# EasyEDA schematic EdgePowerMeter_EasyEDA.json
TITLE: EdgePowerMeter; REV: 1.0; Date: 2025-10-24; Sheet: 1/1; Drawn By: Daniel Rossi; Company: Projecto
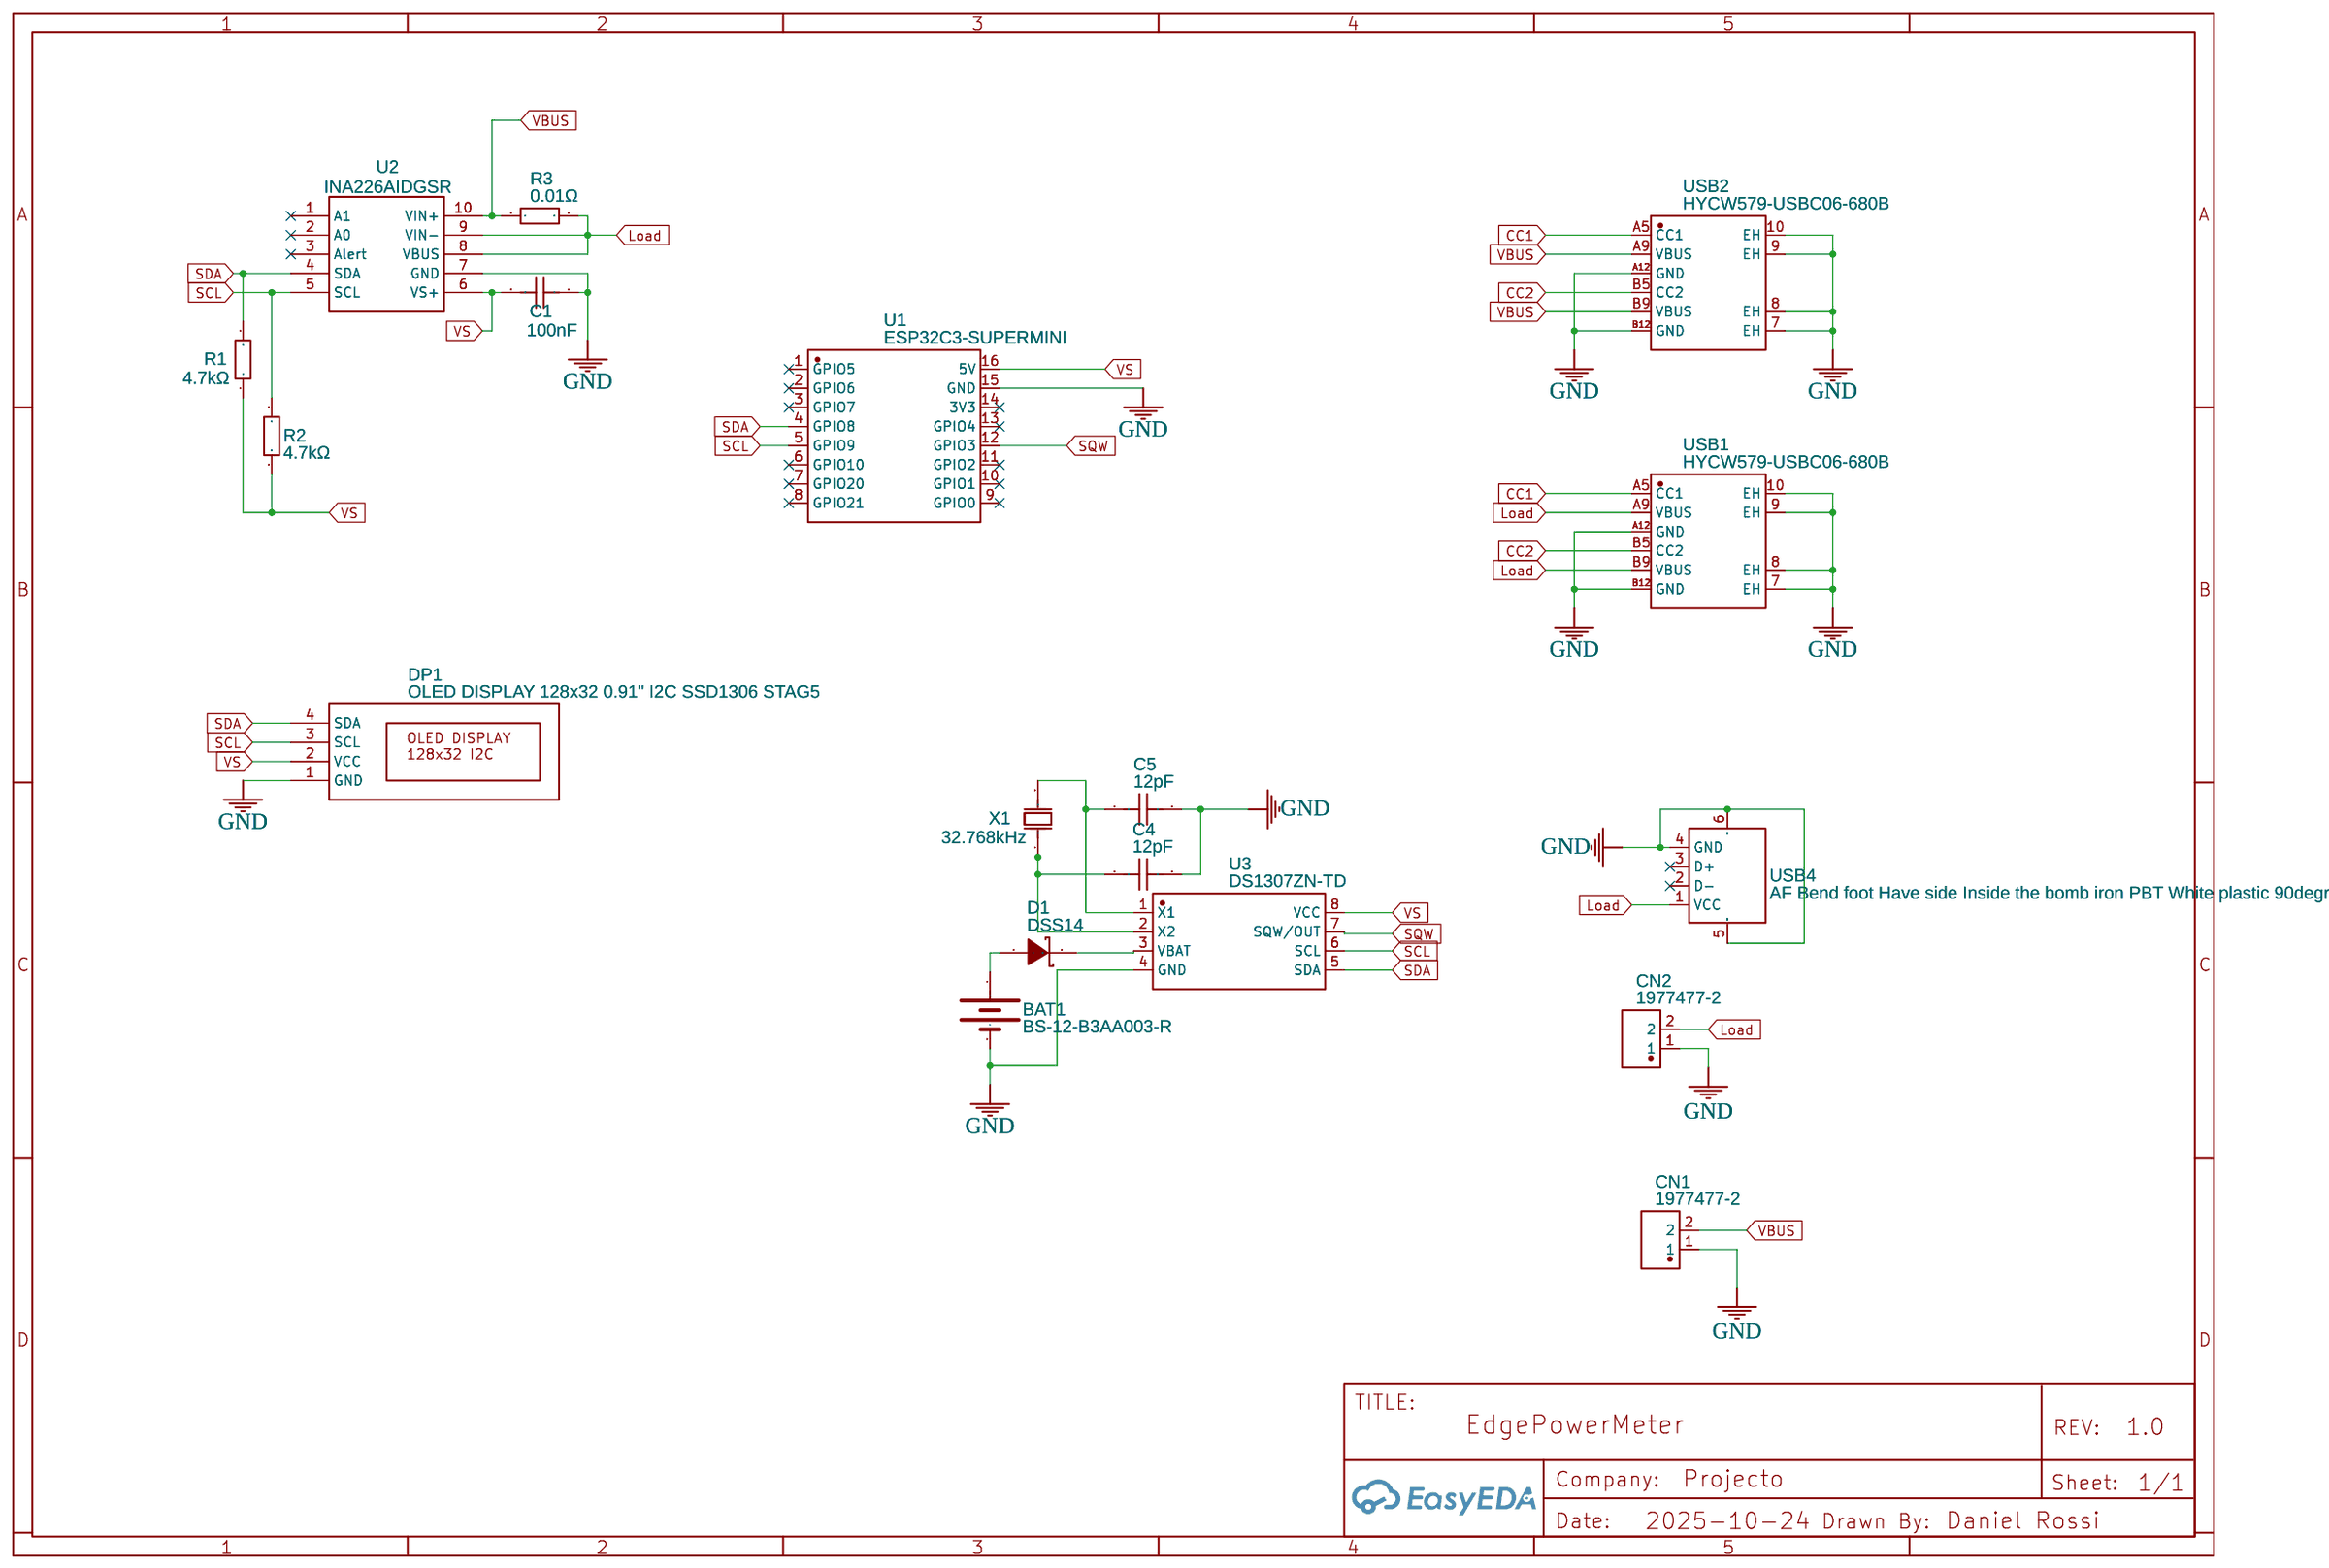
[diagram p0: schematic sheet]

## Parts
BAT1  BS-12-B3AA003-R  [BAT-SMD_CR1220-2_C964724]
C1  100nF  [C1206]
C4  12pF  [C1206]
C5  12pF  [C1206]
CN1  1977477-2  [CONN-TH_2P-P8.25_1977477-2]
CN2  1977477-2  [CONN-TH_2P-P8.25_1977477-2]
D1  DSS14  [SOD-123_L2.8-W1.8-LS3.7-RD]
DP1  OLED DISPLAY 128x32 0.91" I2C SSD1306 STAG5  [OLED-TH-C128-R64-D0.91-I2C-SSD1306-STAG5]
R1  4.7kΩ  [R1206]
R2  4.7kΩ  [R1206]
R3  0.01Ω  [R2512]
U1  ESP32C3-SUPERMINI  [COMM-SMD_16P-L22.5-W18.0-P2.54-TL]
U2  INA226AIDGSR  [MSOP-10_L3.0-W3.0-P0.50-LS5.0-BL]
U3  DS1307ZN-TD  [SOIC-8_L5.0-W4.0-P1.27-LS6.0-BL]
USB1  HYCW579-USBC06-680B  [USB-C-SMD_HYCW579-USBC06-680B]
USB2  HYCW579-USBC06-680B  [USB-C-SMD_HYCW579-USBC06-680B]
USB4  AF Bend foot Have side Inside the bomb iron PBT White plastic 90degree  [USB-A-TH_JTJ-USB-AF-03]
X1  32.768kHz  [CRYSTAL-SMD_L3.2-W1.5]

## Library data of the parts
BAT1 = BS-12-B3AA003-R: Contributor: lcsc; Supplier: LCSC; Supplier Part: C964724; Manufacturer: MYOUNG(美阳); JLCPCB Part Class: Extended Part
C1 = C1206F104K1RAC3083: Contributor: LCSC; Supplier: LCSC; Supplier Part: C141208; Manufacturer: KEMET(基美); JLCPCB Part Class: Extended Part
C4 C5 = 12PF: Contributor: LCSC; Supplier: Farnell; GROUP: CAPACITOR
CN1 CN2 = 1977477-2: Supplier: LCSC; Supplier Part: C3656194; Manufacturer: TE Connectivity(泰科电子); JLCPCB Part Class: Extended Part; Contributor: lcsc
D1 = DSS14: Supplier: LCSC; Manufacturer: 星海; Supplier Part: C59293; JLCPCB Part Class: Extended Part
DP1 = OLED DISPLAY 128x32 0.91" I2C SSD1306 STAG5: Contributor: priyasai1501
R1 R2 = RMC12064.7K1%N: Contributor: LCSC; Supplier: LCSC; Supplier Part: C269592; Manufacturer: Tyohm(幸亚电阻); JLCPCB Part Class: Extended Part
R3 = MRF6432(2512)LR010JTS: Supplier Part: C76272; Supplier: LCSC; Manufacturer: SUP; JLCPCB Part Class: Extended Part
U1 = ESP32C3-SUPERMINI: Supplier: LCSC; Supplier Part: C9900147397; Manufacturer: null; Manufacturer Part: ESP32C3-SuperMini; JLCPCB Part Class: Extended Part; Contributor: lcsc
U2 = INA226AIDGSR: Supplier: LCSC; Manufacturer: TI(德州仪器); Supplier Part: C49851; JLCPCB Part Class: Extended Part
U3 = DS1307ZN-TD: Supplier: LCSC; Supplier Part: C42421871; Manufacturer: TDSEMIC(拓电半导体); Contributor: lcsc; JLCPCB Part Class: Extended Part
USB1 USB2 = HYCW579-USBC06-680B: Supplier: LCSC; Supplier Part: C42400241; Manufacturer: 华宇创; Contributor: lcsc; JLCPCB Part Class: Extended Part
USB4 = AF Bend foot Have side Inside the bomb iron PBT White plastic 90degree: Supplier: LCSC; Manufacturer: 精拓金; Manufacturer Part: 901-131A1011D10100; Supplier Part: C39431; JLCPCB Part Class: Extended Part
X1 = ABS07-120-32.768KHZ-T: Contributor: LCSC; Supplier: LCSC; Supplier Part: C1985240; Manufacturer: ABRACON; JLCPCB Part Class: Extended Part

## Nets
GND: BAT1.2(-) C1.1 C4.1 C5.2 CN1.1 CN2.1 DP1.1(GND) U1.15(GND) U2.7(GND) U3.4(GND) USB1.7(EH) USB1.8(EH) USB1.9(EH) USB1.10(EH) USB1.A12(GND) USB1.B12(GND) USB2.7(EH) USB2.8(EH) USB2.9(EH) USB2.10(EH) USB2.A12(GND) USB2.B12(GND) USB4.4(GND) USB4.5(SH2) USB4.6(SH1)
VBUS: CN1.2 R3.1 U2.10(VIN+) USB2.A9(VBUS) USB2.B9(VBUS)
CC1: USB1.A5(CC1) USB2.A5(CC1)
CC2: USB1.B5(CC2) USB2.B5(CC2)
Load: CN2.2 R3.2 U2.8(VBUS) U2.9(VIN-) USB1.A9(VBUS) USB1.B9(VBUS) USB4.1(VCC)
SCL: DP1.3(SCL) R2.2 U1.5(GPIO9) U2.5(SCL) U3.6(SCL)
SDA: DP1.4(SDA) R1.2 U1.4(GPIO8) U2.4(SDA) U3.5(SDA)
SQW: U1.12(GPIO3) U3.7(SQW/OUT)
VS: C1.2 DP1.2(VCC) R1.1 R2.1 U1.16(5V) U2.6(VS+) U3.8(VCC)
Net-(BAT1-1): BAT1.1(+) D1.2(A)
Net-(C4-2): C4.2 U3.2(X2) X1.1(OSC1)
Net-(C5-1): C5.1 U3.1(X1) X1.2(OSC2)
Net-(D1-1): D1.1(K) U3.3(VBAT)

Not connected (* = marked no-connect by the designer): U1 1(GPIO5)* 2(GPIO6)* 3(GPIO7)* 6(GPIO10)* 7(GPIO20)* 8(GPIO21)* 9(GPIO0)* 10(GPIO1)* 11(GPIO2)* 13(GPIO4)* 14(3V3)*; U2 1(A1)* 2(A0)* 3(Alert)*; USB4 2(D-)* 3(D+)*
